# Altium project FET_Driver.PrjPcb (part 3 of 3)

## Sheet current_sense.SchDoc
size B; Address1: MILWAUKEE TOOL; Address2: 13135 W. Lisbon Rd.; Address3: Brookfield, WI 53005; SheetNumber: 1; SheetTotal: 1
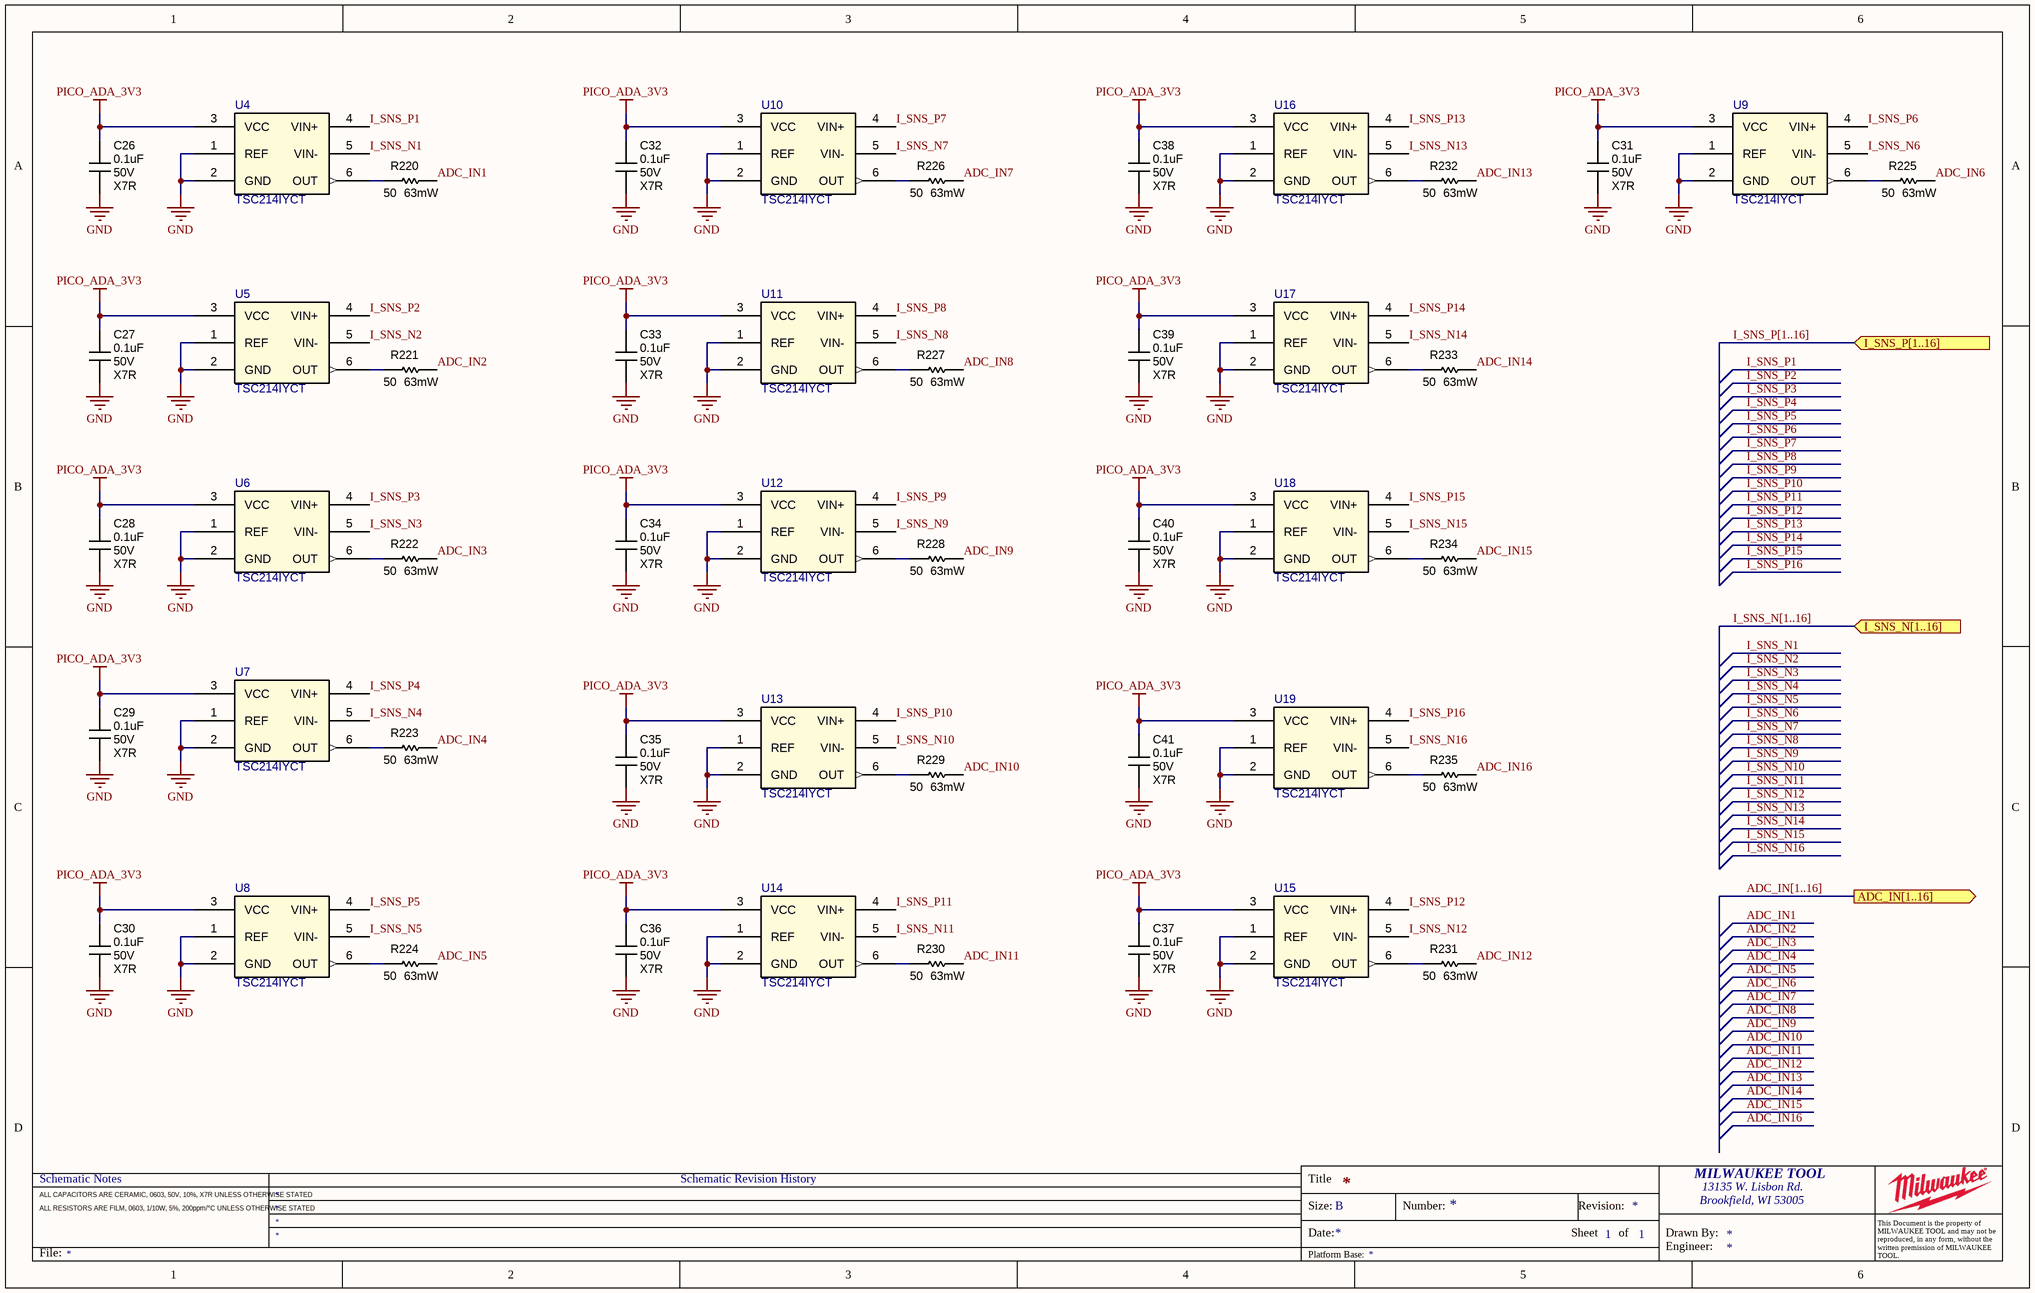
[diagram p9: current_sense.SchDoc]

### Parts
C26  0.1uF  Voltage Rating: 50V  Temp Coeff: X7R  [CAPC1005X06N]
C27  0.1uF  Voltage Rating: 50V  Temp Coeff: X7R  [CAPC1005X06N]
C28  0.1uF  Voltage Rating: 50V  Temp Coeff: X7R  [CAPC1005X06N]
C29  0.1uF  Voltage Rating: 50V  Temp Coeff: X7R  [CAPC1005X06N]
C30  0.1uF  Voltage Rating: 50V  Temp Coeff: X7R  [CAPC1005X06N]
C31  0.1uF  Voltage Rating: 50V  Temp Coeff: X7R  [CAPC1005X06N]
C32  0.1uF  Voltage Rating: 50V  Temp Coeff: X7R  [CAPC1005X06N]
C33  0.1uF  Voltage Rating: 50V  Temp Coeff: X7R  [CAPC1005X06N]
C34  0.1uF  Voltage Rating: 50V  Temp Coeff: X7R  [CAPC1005X06N]
C35  0.1uF  Voltage Rating: 50V  Temp Coeff: X7R  [CAPC1005X06N]
C36  0.1uF  Voltage Rating: 50V  Temp Coeff: X7R  [CAPC1005X06N]
C37  0.1uF  Voltage Rating: 50V  Temp Coeff: X7R  [CAPC1005X06N]
C38  0.1uF  Voltage Rating: 50V  Temp Coeff: X7R  [CAPC1005X06N]
C39  0.1uF  Voltage Rating: 50V  Temp Coeff: X7R  [CAPC1005X06N]
C40  0.1uF  Voltage Rating: 50V  Temp Coeff: X7R  [CAPC1005X06N]
C41  0.1uF  Voltage Rating: 50V  Temp Coeff: X7R  [CAPC1005X06N]
R220  50  Wattage: 63mW  [RESC1005X04N]
R221  50  Wattage: 63mW  [RESC1005X04N]
R222  50  Wattage: 63mW  [RESC1005X04N]
R223  50  Wattage: 63mW  [RESC1005X04N]
R224  50  Wattage: 63mW  [RESC1005X04N]
R225  50  Wattage: 63mW  [RESC1005X04N]
R226  50  Wattage: 63mW  [RESC1005X04N]
R227  50  Wattage: 63mW  [RESC1005X04N]
R228  50  Wattage: 63mW  [RESC1005X04N]
R229  50  Wattage: 63mW  [RESC1005X04N]
R230  50  Wattage: 63mW  [RESC1005X04N]
R231  50  Wattage: 63mW  [RESC1005X04N]
R232  50  Wattage: 63mW  [RESC1005X04N]
R233  50  Wattage: 63mW  [RESC1005X04N]
R234  50  Wattage: 63mW  [RESC1005X04N]
R235  50  Wattage: 63mW  [RESC1005X04N]
U4  TSC214IYCT  [SOT65P210X110-6N]
U5  TSC214IYCT  [SOT65P210X110-6N]
U6  TSC214IYCT  [SOT65P210X110-6N]
U7  TSC214IYCT  [SOT65P210X110-6N]
U8  TSC214IYCT  [SOT65P210X110-6N]
U9  TSC214IYCT  [SOT65P210X110-6N]
U10  TSC214IYCT  [SOT65P210X110-6N]
U11  TSC214IYCT  [SOT65P210X110-6N]
U12  TSC214IYCT  [SOT65P210X110-6N]
U13  TSC214IYCT  [SOT65P210X110-6N]
U14  TSC214IYCT  [SOT65P210X110-6N]
U15  TSC214IYCT  [SOT65P210X110-6N]
U16  TSC214IYCT  [SOT65P210X110-6N]
U17  TSC214IYCT  [SOT65P210X110-6N]
U18  TSC214IYCT  [SOT65P210X110-6N]
U19  TSC214IYCT  [SOT65P210X110-6N]

### Ports
ADC_IN[1..16] (out), I_SNS_N[1..16] (in), I_SNS_P[1..16] (in)

### Nets
GND: C26.2 C27.2 C28.2 C29.2 C30.2 C31.2 C32.2 C33.2 C34.2 C35.2 C36.2 C37.2 C38.2 C39.2 C40.2 C41.2 U4.1(REF) U4.2(GND) U5.1(REF) U5.2(GND) U6.1(REF) U6.2(GND) U7.1(REF) U7.2(GND) U8.1(REF) U8.2(GND) U9.1(REF) U9.2(GND) U10.1(REF) U10.2(GND) U11.1(REF) U11.2(GND) U12.1(REF) U12.2(GND) U13.1(REF) U13.2(GND) U14.1(REF) U14.2(GND) U15.1(REF) U15.2(GND) U16.1(REF) U16.2(GND) U17.1(REF) U17.2(GND) U18.1(REF) U18.2(GND) U19.1(REF) U19.2(GND)
PICO_ADA_3V3: C26.1 C27.1 C28.1 C29.1 C30.1 C31.1 C32.1 C33.1 C34.1 C35.1 C36.1 C37.1 C38.1 C39.1 C40.1 C41.1 U4.3(VCC) U5.3(VCC) U6.3(VCC) U7.3(VCC) U8.3(VCC) U9.3(VCC) U10.3(VCC) U11.3(VCC) U12.3(VCC) U13.3(VCC) U14.3(VCC) U15.3(VCC) U16.3(VCC) U17.3(VCC) U18.3(VCC) U19.3(VCC)
ADC_IN1: R220.2
ADC_IN2: R221.2
ADC_IN3: R222.2
ADC_IN4: R223.2
ADC_IN5: R224.2
ADC_IN6: R225.2
ADC_IN7: R226.2
ADC_IN8: R227.2
ADC_IN9: R228.2
ADC_IN10: R229.2
ADC_IN11: R230.2
ADC_IN12: R231.2
ADC_IN13: R232.2
ADC_IN14: R233.2
ADC_IN15: R234.2
ADC_IN16: R235.2
I_SNS_N1: U4.5(VIN-)
I_SNS_N2: U5.5(VIN-)
I_SNS_N3: U6.5(VIN-)
I_SNS_N4: U7.5(VIN-)
I_SNS_N5: U8.5(VIN-)
I_SNS_N6: U9.5(VIN-)
I_SNS_N7: U10.5(VIN-)
I_SNS_N8: U11.5(VIN-)
I_SNS_N9: U12.5(VIN-)
I_SNS_N10: U13.5(VIN-)
I_SNS_N11: U14.5(VIN-)
I_SNS_N12: U15.5(VIN-)
I_SNS_N13: U16.5(VIN-)
I_SNS_N14: U17.5(VIN-)
I_SNS_N15: U18.5(VIN-)
I_SNS_N16: U19.5(VIN-)
I_SNS_P1: U4.4(VIN+)
I_SNS_P2: U5.4(VIN+)
I_SNS_P3: U6.4(VIN+)
I_SNS_P4: U7.4(VIN+)
I_SNS_P5: U8.4(VIN+)
I_SNS_P6: U9.4(VIN+)
I_SNS_P7: U10.4(VIN+)
I_SNS_P8: U11.4(VIN+)
I_SNS_P9: U12.4(VIN+)
I_SNS_P10: U13.4(VIN+)
I_SNS_P11: U14.4(VIN+)
I_SNS_P12: U15.4(VIN+)
I_SNS_P13: U16.4(VIN+)
I_SNS_P14: U17.4(VIN+)
I_SNS_P15: U18.4(VIN+)
I_SNS_P16: U19.4(VIN+)
NetR220_1: R220.1 U4.6(OUT)
NetR221_1: R221.1 U5.6(OUT)
NetR222_1: R222.1 U6.6(OUT)
NetR223_1: R223.1 U7.6(OUT)
NetR224_1: R224.1 U8.6(OUT)
NetR225_1: R225.1 U9.6(OUT)
NetR226_1: R226.1 U10.6(OUT)
NetR227_1: R227.1 U11.6(OUT)
NetR228_1: R228.1 U12.6(OUT)
NetR229_1: R229.1 U13.6(OUT)
NetR230_1: R230.1 U14.6(OUT)
NetR231_1: R231.1 U15.6(OUT)
NetR232_1: R232.1 U16.6(OUT)
NetR233_1: R233.1 U17.6(OUT)
NetR234_1: R234.1 U18.6(OUT)
NetR235_1: R235.1 U19.6(OUT)

### Buses and harness runs
bus ADC_IN[1..16] = port ADC_IN[1..16]
bus I_SNS_N[1..16] = port I_SNS_N[1..16]
bus I_SNS_P[1..16] = port I_SNS_P[1..16]

### Notes on the sheet
- Schematic Notes
- Schematic Revision History
- Title
- ALL CAPACITORS ARE CERAMIC, 0603, 50V, 10%, X7R UNLESS OTHERWISE STATED
- ALL RESISTORS ARE FILM, 0603, 1/10W, 5%, 200ppm/°C UNLESS OTHERWISE STATED
- Size:
- Date:
- B
- Number:
- Sheet
- Revision:
- of
- Drawn By:
- Brookfield, WI 53005
- File:
- Platform Base:
- Engineer:
- This Document is the property of MILWAUKEE TOOL and may not be reproduced, in any form, without the written premission of MILWAUKEE TOOL.

### Library data of the parts
C26-C41 = CMP-004-0076: as C45-C47 on sheet thermocouple_1; Case Code (Imperial): 0402; Value: 0.1uF; MFR4: Samsung Electro-Mechanics; Design Item ID: CN/0.1uF/50V/X7R/10%/0402; Case Code (Metric): 1005; ComponentLink1URL: https://search.murata.co.jp/Ceramy/image/img/A01X/G101/ENG/GRM155R71H104KE14-01.pdf; MFR3: KYOCERA AVX; MFR2: TDK Corporation; ComponentLink1Description: Datasheet; RoHS Compliant: Yes; Part Status: Production
R220-R235 = CMP-025-0174: RES SMD 50R OHM 1% 1/16W 0402; MFR#: RN73R1ETTP50R0F50; MFR: KOA Speer Electronics; Value: 50 Ohm; Temp Range: -55 / +155 C; Temperature Coefficient: 50 ppm/°C; Populate: Yes; Tolerance: 1%; ComponentLink1Description: Datasheet; ComponentLink1URL: https://www.koaspeer.com/pdfs/RN73R.pdf; Resistor Type: Thick Film; Case Code (Imperial): 0402; Case Code (Metric): 1005; Design Item ID: R/50.0/0.063W/1%/0402; RoHS Compliant: Yes; Part Status: Production
U4-U19 = CMP-017-0113: IC CURR SENSE 1 CIRCUIT SC70-6; MFR: STMicroelectronics; Populate: Yes; REACFH SVCH: Unaffected; Temp Range, Ambient: -40 / +85 C; Voltage Range: 2.7V - 26V DC; Temp Range, Junction: -40 / +125C; Value: TSC214IYCT; MFR#: TSC214IYCT; Case Package: sot23-6; Design Item ID: IC/I_SNS/TSC214/SOT23-6; Part Status: Production; RoHS Comliant: Yes; Type: CURRENT SENSOR; ComponentLink1Description: Datasheet; ComponentLink1URL: https://www.st.com/resource/en/datasheet/tsc210.pdf

## Sheet pwm_driver.SchDoc
size B; Address1: MILWAUKEE TOOL; Address2: 13135 W. Lisbon Rd.; Address3: Brookfield, WI 53005; SheetNumber: 1; SheetTotal: 1
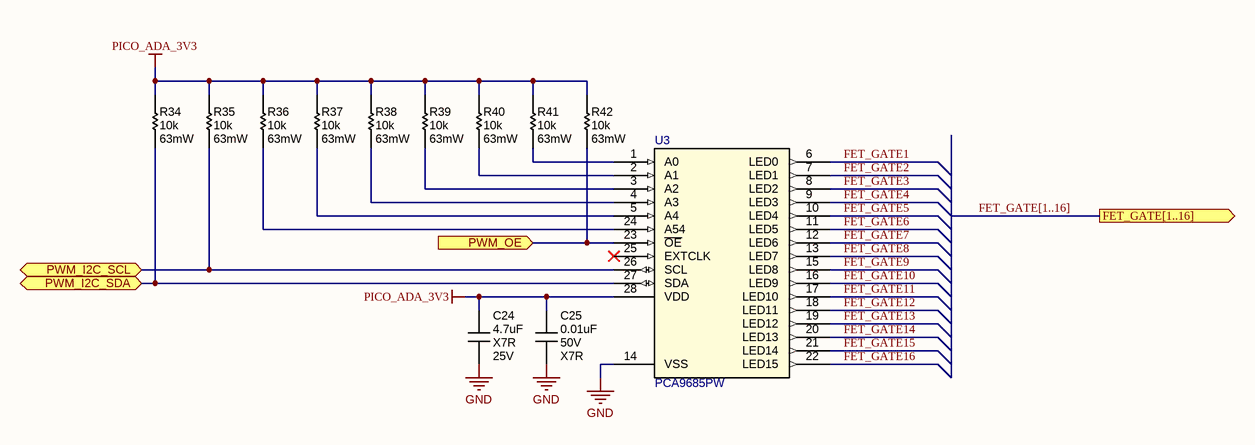
[diagram p10: pwm_driver.SchDoc]

### Parts
C24  4.7uF  Temp Coeff: X7R  Voltage Rating: 25V  [CAPC2012X14N]
C25  0.01uF  Voltage Rating: 50V  Temp Coeff: X7R  [CAPC1005X06N]
R34  10k  Wattage: 63mW  [RESC1005X04N]
R35  10k  Wattage: 63mW  [RESC1005X04N]
R36  10k  Wattage: 63mW  [RESC1005X04N]
R37  10k  Wattage: 63mW  [RESC1005X04N]
R38  10k  Wattage: 63mW  [RESC1005X04N]
R39  10k  Wattage: 63mW  [RESC1005X04N]
R40  10k  Wattage: 63mW  [RESC1005X04N]
R41  10k  Wattage: 63mW  [RESC1005X04N]
R42  10k  Wattage: 63mW  [RESC1005X04N]
U3  PCA9685PW  [SOP65P640X120-29N]

### Ports
FET_GATE[1..16] (out), PWM_I2C_SCL (bidir), PWM_I2C_SDA (bidir), PWM_OE (in)

### Nets
GND: C24.2 C25.2 U3.14(VSS)
PICO_ADA_3V3: C24.1 C25.1 R34.2 R35.2 R36.2 R37.2 R38.2 R39.2 R40.2 R41.2 R42.2 U3.28(VDD)
FET_GATE1: U3.6(LED0)
FET_GATE2: U3.7(LED1)
FET_GATE3: U3.8(LED2)
FET_GATE4: U3.9(LED3)
FET_GATE5: U3.10(LED4)
FET_GATE6: U3.11(LED5)
FET_GATE7: U3.12(LED6)
FET_GATE8: U3.13(LED7)
FET_GATE9: U3.15(LED8)
FET_GATE10: U3.16(LED9)
FET_GATE11: U3.17(LED10)
FET_GATE12: U3.18(LED11)
FET_GATE13: U3.19(LED12)
FET_GATE14: U3.20(LED13)
FET_GATE15: U3.21(LED14)
FET_GATE16: U3.22(LED15)
I2C1_SCL: R35.1 U3.26(SCL) ; port PWM_I2C_SCL
I2C1_SDA: R34.1 U3.27(SDA) ; port PWM_I2C_SDA
OUTPUT_ENABLE: R42.1 U3.23(~{OE}) ; port PWM_OE
NetR36_1: R36.1 U3.24(A54)
NetR37_1: R37.1 U3.5(A4)
NetR38_1: R38.1 U3.4(A3)
NetR39_1: R39.1 U3.3(A2)
NetR40_1: R40.1 U3.2(A1)
NetR41_1: R41.1 U3.1(A0)

Not connected (* = marked no-connect by the designer): U3 25(EXTCLK)*

### Buses and harness runs
bus FET_GATE[1..16] = port FET_GATE[1..16]

### Notes on the sheet
- Schematic Notes
- Schematic Revision History
- Title
- ALL CAPACITORS ARE CERAMIC, 0603, 50V, 10%, X7R UNLESS OTHERWISE STATED
- ALL RESISTORS ARE FILM, 0603, 1/10W, 5%, 200ppm/°C UNLESS OTHERWISE STATED
- Size:
- Date:
- B
- Number:
- Sheet
- Revision:
- of
- Drawn By:
- Brookfield, WI 53005
- File:
- Platform Base:
- Engineer:
- This Document is the property of MILWAUKEE TOOL and may not be reproduced, in any form, without the written premission of MILWAUKEE TOOL.

### Library data of the parts
C24 = CMP-004-0011: CAP CER 4.7UF 25V X7R 0805; MFR: TDK Corporation; MFR3#: 0805B475K500NT; MFR#: C2012X7R1E475K125AE; MFR2#: CL21B475KAFNNNE; Temp Range: -55 / +125 C; Tolerance: 10%; Capacitor Type: Ceramic; MFR2: Samsung Electro-Mechanics; Case Code (Metric): 2012; REACH SVHC: Yes; ComponentLink1URL: https://search.murata.co.jp/Ceramy/image/img/A01X/G101/ENG/GRM32EC72A106KE05-01.pdf; MFR3: FengHua; Design Item ID: CN/4.7uF/25V/X7R/10%/0805; Value: 4.7uF; RoHS Compliant: Yes; ComponentLink1Description: Datasheet; Case Code (Imperial): 0805
C25 = CMP-004-0077: CAP CER SMD 0.01UF 50V X7R 0402; MFR3#: C0402C103K5RAC7867; MFR#: GCM155R71H103KA55D; MFR: Murata Electronics; MFR4#: CL05B103KB5NNNC; MFR2#: CC0402KRX7R9BB103; Tolerance: 10%; Populate: Yes; Temp Range: -55 / +125 C; Capacitor Type: Ceramic; Case Code (Imperial): 0402; Value: 0.01uF; MFR4: Samsung Electro-Mechanics; Design Item ID: CN/0.01UF/50V/X7R/10%/0402; Case Code (Metric): 1005; ComponentLink1URL: https://search.murata.co.jp/Ceramy/image/img/A01X/G101/ENG/GCM155R71H103KA55-01.pdf; MFR3: KEMET; MFR2: YAGEO; ComponentLink1Description: Datasheet; RoHS Compliant: Yes; Part Status: Production
R34-R42 = CMP-025-0026: as R52-R54 on sheet thermocouple_1; MFR2: Stackpole Electronics Inc; RoHS Compliant: Yes; ComponentLink1Description: Datasheet; REACH SVHC: Yes; Value: 10k; Case Code (Imperial): 0402; Case Code (Metric): 1005; Tolerance: 0.5%; Resistor Type: Thick Film; Design Item ID: R/10.0K/0.063W/0.5%/0402; ComponentLink1URL: https://industrial.panasonic.com/cdbs/www-data/pdf/RDM0000/AOA0000C307.pdf
U3 = CMP-017-0112: IC LED DRVR LIN PWM 25MA 28TSSOP; MFR: NXP; Value: PCA9685PW,118; Populate: Yes; REACFH SVCH: Unaffected; Temp Range, Ambient: -40 / +85 C; Voltage Range: 2.3V - 5.5V DC; Temp Range, Junction: -40 / +125C; MFR#: PCA9685PW,118; Case Package: TSSOP28; Design Item ID: IC/LDRV/PCA9685PW/TSSOP28; Part Status: Production; RoHS Comliant: Yes; Type: PWM CONTROLLER; ComponentLink1Description: Datasheet; ComponentLink1URL: https://www.nxp.com/docs/en/data-sheet/PCA9685.pdf

## Sheet FETS.SchDoc
size B; Address1: MILWAUKEE TOOL; Address2: 13135 W. Lisbon Rd.; Address3: Brookfield, WI 53005; SheetNumber: 1; SheetTotal: 1
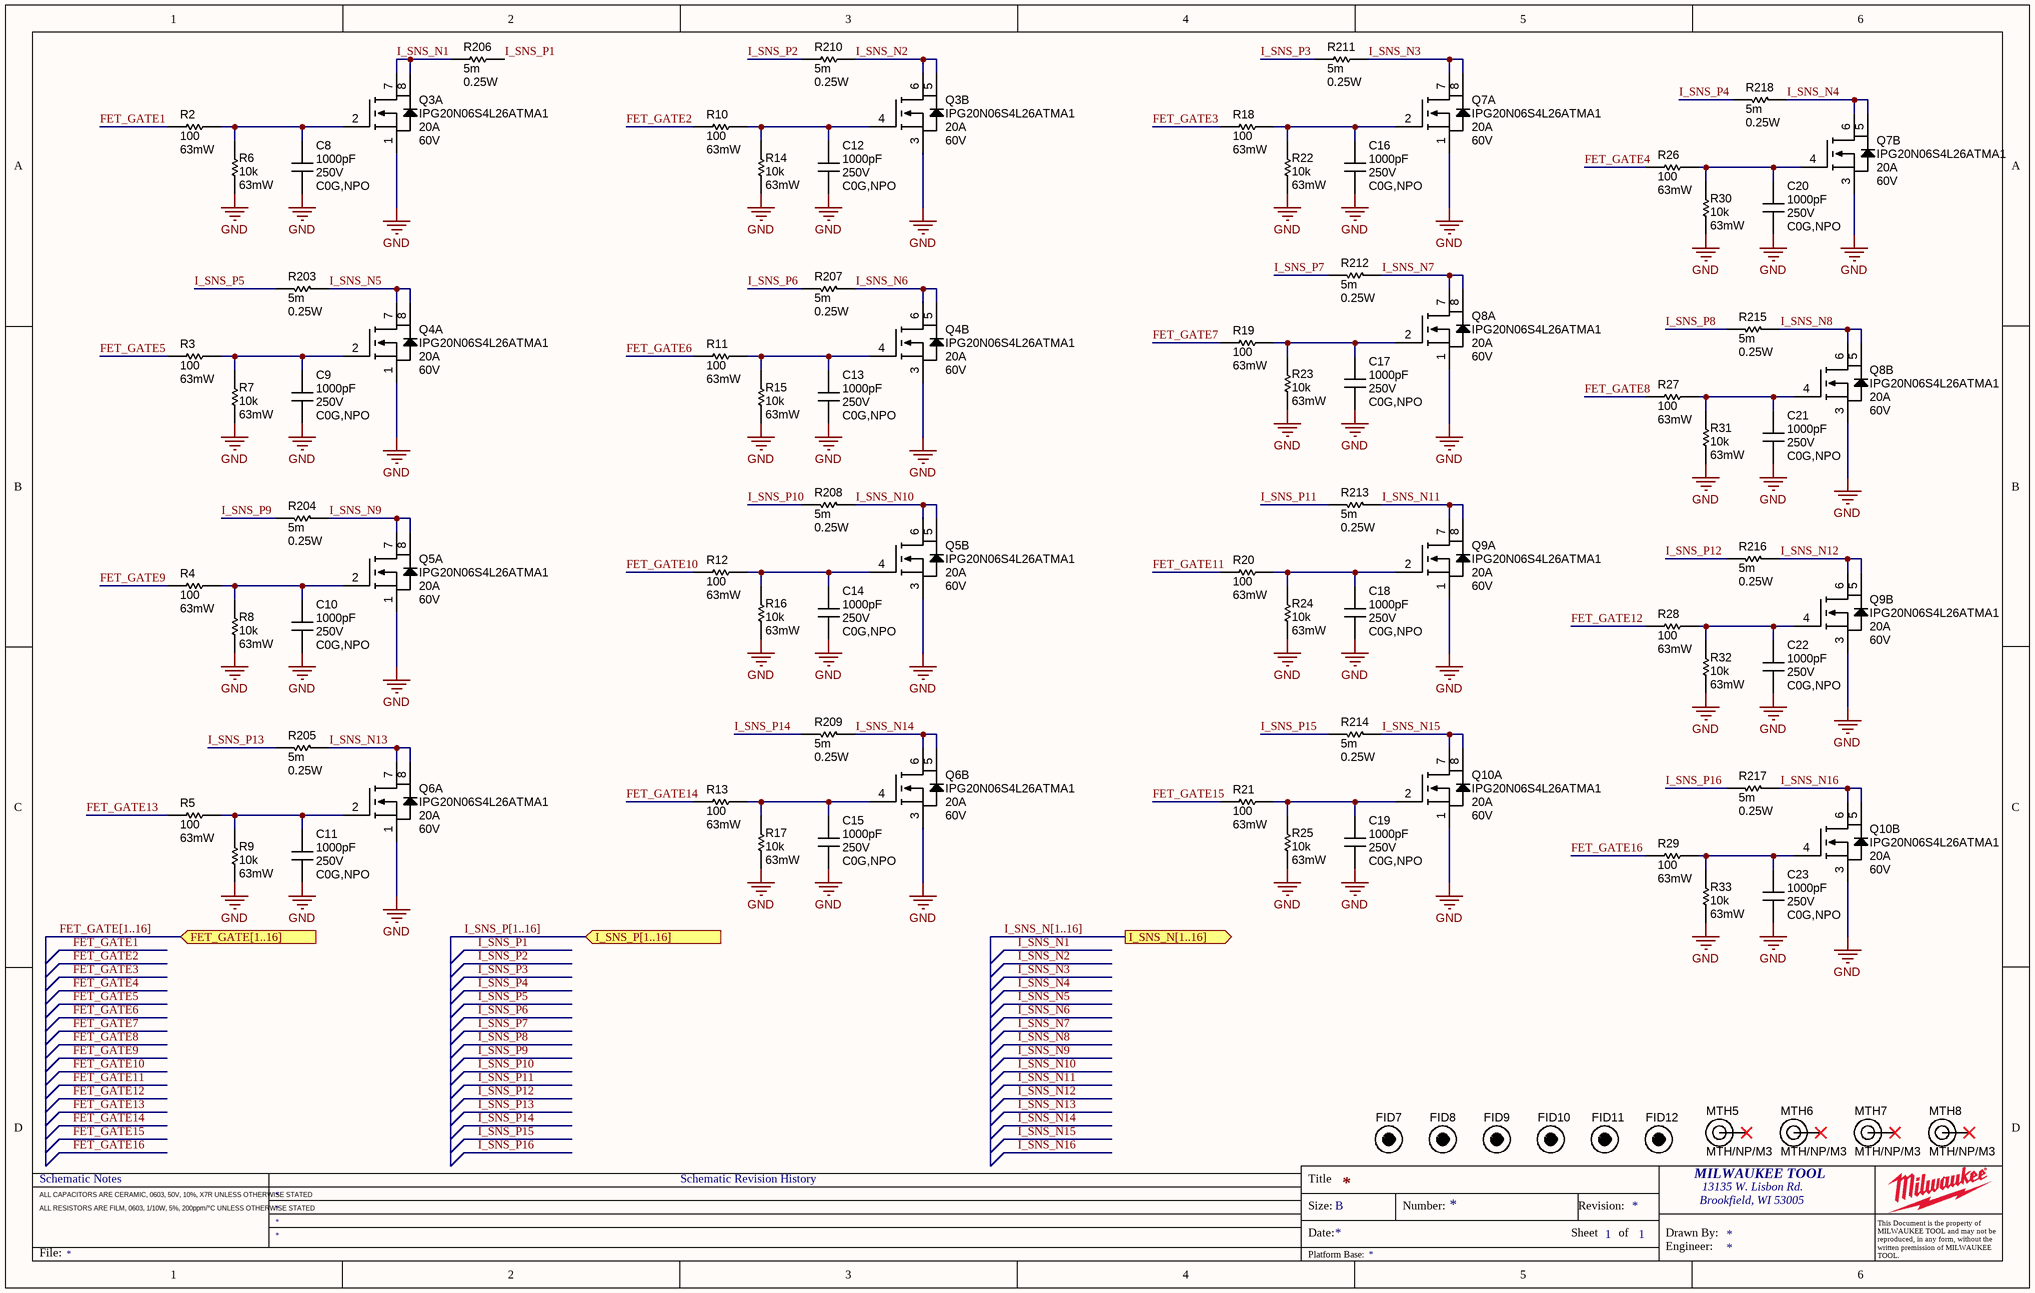
[diagram p11: FETS.SchDoc]

### Parts
C8  1000pF  Voltage Rating: 250V  Temp Coeff: C0G,NPO  [CAPC1608X09N]
C9  1000pF  Voltage Rating: 250V  Temp Coeff: C0G,NPO  [CAPC1608X09N]
C10  1000pF  Voltage Rating: 250V  Temp Coeff: C0G,NPO  [CAPC1608X09N]
C11  1000pF  Voltage Rating: 250V  Temp Coeff: C0G,NPO  [CAPC1608X09N]
C12  1000pF  Voltage Rating: 250V  Temp Coeff: C0G,NPO  [CAPC1608X09N]
C13  1000pF  Voltage Rating: 250V  Temp Coeff: C0G,NPO  [CAPC1608X09N]
C14  1000pF  Voltage Rating: 250V  Temp Coeff: C0G,NPO  [CAPC1608X09N]
C15  1000pF  Voltage Rating: 250V  Temp Coeff: C0G,NPO  [CAPC1608X09N]
C16  1000pF  Voltage Rating: 250V  Temp Coeff: C0G,NPO  [CAPC1608X09N]
C17  1000pF  Voltage Rating: 250V  Temp Coeff: C0G,NPO  [CAPC1608X09N]
C18  1000pF  Voltage Rating: 250V  Temp Coeff: C0G,NPO  [CAPC1608X09N]
C19  1000pF  Voltage Rating: 250V  Temp Coeff: C0G,NPO  [CAPC1608X09N]
C20  1000pF  Voltage Rating: 250V  Temp Coeff: C0G,NPO  [CAPC1608X09N]
C21  1000pF  Voltage Rating: 250V  Temp Coeff: C0G,NPO  [CAPC1608X09N]
C22  1000pF  Voltage Rating: 250V  Temp Coeff: C0G,NPO  [CAPC1608X09N]
C23  1000pF  Voltage Rating: 250V  Temp Coeff: C0G,NPO  [CAPC1608X09N]
FID7  FIDUCIAL STANDARD  [FID]  (value not drawn)  (no BOM)
FID8  FIDUCIAL STANDARD  [FID]  (value not drawn)  (no BOM)
FID9  FIDUCIAL STANDARD  [FID]  (value not drawn)  (no BOM)
FID10  FIDUCIAL STANDARD  [FID]  (value not drawn)  (no BOM)
FID11  FIDUCIAL STANDARD  [FID]  (value not drawn)  (no BOM)
FID12  FIDUCIAL STANDARD  [FID]  (value not drawn)  (no BOM)
MTH5  MTH/NP/M3  [MTGNP700H325Z700P]  (no BOM)
MTH6  MTH/NP/M3  [MTGNP700H325Z700P]  (no BOM)
MTH7  MTH/NP/M3  [MTGNP700H325Z700P]  (no BOM)
MTH8  MTH/NP/M3  [MTGNP700H325Z700P]  (no BOM)
Q3  IPG20N06S4L26ATMA1  Current: 20A  Voltage: 60V  [INF-PG-TDSON-8-4]  (parts A,B of 2)
Q4  IPG20N06S4L26ATMA1  Current: 20A  Voltage: 60V  [INF-PG-TDSON-8-4]  (parts A,B of 2)
Q5  IPG20N06S4L26ATMA1  Current: 20A  Voltage: 60V  [INF-PG-TDSON-8-4]  (parts A,B of 2)
Q6  IPG20N06S4L26ATMA1  Current: 20A  Voltage: 60V  [INF-PG-TDSON-8-4]  (parts A,B of 2)
Q7  IPG20N06S4L26ATMA1  Current: 20A  Voltage: 60V  [INF-PG-TDSON-8-4]  (parts A,B of 2)
Q8  IPG20N06S4L26ATMA1  Current: 20A  Voltage: 60V  [INF-PG-TDSON-8-4]  (parts A,B of 2)
Q9  IPG20N06S4L26ATMA1  Current: 20A  Voltage: 60V  [INF-PG-TDSON-8-4]  (parts A,B of 2)
Q10  IPG20N06S4L26ATMA1  Current: 20A  Voltage: 60V  [INF-PG-TDSON-8-4]  (parts A,B of 2)
R2  100  Wattage: 63mW  [RESC1005X04N]
R3  100  Wattage: 63mW  [RESC1005X04N]
R4  100  Wattage: 63mW  [RESC1005X04N]
R5  100  Wattage: 63mW  [RESC1005X04N]
R6  10k  Wattage: 63mW  [RESC1005X04N]
R7  10k  Wattage: 63mW  [RESC1005X04N]
R8  10k  Wattage: 63mW  [RESC1005X04N]
R9  10k  Wattage: 63mW  [RESC1005X04N]
R10  100  Wattage: 63mW  [RESC1005X04N]
R11  100  Wattage: 63mW  [RESC1005X04N]
R12  100  Wattage: 63mW  [RESC1005X04N]
R13  100  Wattage: 63mW  [RESC1005X04N]
R14  10k  Wattage: 63mW  [RESC1005X04N]
R15  10k  Wattage: 63mW  [RESC1005X04N]
R16  10k  Wattage: 63mW  [RESC1005X04N]
R17  10k  Wattage: 63mW  [RESC1005X04N]
R18  100  Wattage: 63mW  [RESC1005X04N]
R19  100  Wattage: 63mW  [RESC1005X04N]
R20  100  Wattage: 63mW  [RESC1005X04N]
R21  100  Wattage: 63mW  [RESC1005X04N]
R22  10k  Wattage: 63mW  [RESC1005X04N]
R23  10k  Wattage: 63mW  [RESC1005X04N]
R24  10k  Wattage: 63mW  [RESC1005X04N]
R25  10k  Wattage: 63mW  [RESC1005X04N]
R26  100  Wattage: 63mW  [RESC1005X04N]
R27  100  Wattage: 63mW  [RESC1005X04N]
R28  100  Wattage: 63mW  [RESC1005X04N]
R29  100  Wattage: 63mW  [RESC1005X04N]
R30  10k  Wattage: 63mW  [RESC1005X04N]
R31  10k  Wattage: 63mW  [RESC1005X04N]
R32  10k  Wattage: 63mW  [RESC1005X04N]
R33  10k  Wattage: 63mW  [RESC1005X04N]
R203  5m  Wattage: 0.25W  [RESC3115X07N]
R204  5m  Wattage: 0.25W  [RESC3115X07N]
R205  5m  Wattage: 0.25W  [RESC3115X07N]
R206  5m  Wattage: 0.25W  [RESC3115X07N]
R207  5m  Wattage: 0.25W  [RESC3115X07N]
R208  5m  Wattage: 0.25W  [RESC3115X07N]
R209  5m  Wattage: 0.25W  [RESC3115X07N]
R210  5m  Wattage: 0.25W  [RESC3115X07N]
R211  5m  Wattage: 0.25W  [RESC3115X07N]
R212  5m  Wattage: 0.25W  [RESC3115X07N]
R213  5m  Wattage: 0.25W  [RESC3115X07N]
R214  5m  Wattage: 0.25W  [RESC3115X07N]
R215  5m  Wattage: 0.25W  [RESC3115X07N]
R216  5m  Wattage: 0.25W  [RESC3115X07N]
R217  5m  Wattage: 0.25W  [RESC3115X07N]
R218  5m  Wattage: 0.25W  [RESC3115X07N]

### Ports
FET_GATE[1..16] (in), I_SNS_N[1..16] (out), I_SNS_P[1..16] (in)

### Nets
GND: C8.2 C9.2 C10.2 C11.2 C12.2 C13.2 C14.2 C15.2 C16.2 C17.2 C18.2 C19.2 C20.2 C21.2 C22.2 C23.2 Q3.1(S) Q3.3(S) Q4.1(S) Q4.3(S) Q5.1(S) Q5.3(S) Q6.1(S) Q6.3(S) Q7.1(S) Q7.3(S) Q8.1(S) Q8.3(S) Q9.1(S) Q9.3(S) Q10.1(S) Q10.3(S) R6.1 R7.1 R8.1 R9.1 R14.1 R15.1 R16.1 R17.1 R22.1 R23.1 R24.1 R25.1 R30.1 R31.1 R32.1 R33.1
FET_GATE1: R2.1
FET_GATE2: R10.1
FET_GATE3: R18.1
FET_GATE4: R26.1
FET_GATE5: R3.1
FET_GATE6: R11.1
FET_GATE7: R19.1
FET_GATE8: R27.1
FET_GATE9: R4.1
FET_GATE10: R12.1
FET_GATE11: R20.1
FET_GATE12: R28.1
FET_GATE13: R5.1
FET_GATE14: R13.1
FET_GATE15: R21.1
FET_GATE16: R29.1
I_SNS_N1: Q3.7(D) Q3.8(D) R206.1
I_SNS_N2: Q3.5(D) Q3.6(D) R210.2
I_SNS_N3: Q7.7(D) Q7.8(D) R211.2
I_SNS_N4: Q7.5(D) Q7.6(D) R218.1
I_SNS_N5: Q4.7(D) Q4.8(D) R203.1
I_SNS_N6: Q4.5(D) Q4.6(D) R207.1
I_SNS_N7: Q8.7(D) Q8.8(D) R212.1
I_SNS_N8: Q8.5(D) Q8.6(D) R215.1
I_SNS_N9: Q5.7(D) Q5.8(D) R204.1
I_SNS_N10: Q5.5(D) Q5.6(D) R208.1
I_SNS_N11: Q9.7(D) Q9.8(D) R213.1
I_SNS_N12: Q9.5(D) Q9.6(D) R216.1
I_SNS_N13: Q6.7(D) Q6.8(D) R205.1
I_SNS_N14: Q6.5(D) Q6.6(D) R209.1
I_SNS_N15: Q10.7(D) Q10.8(D) R214.1
I_SNS_N16: Q10.5(D) Q10.6(D) R217.1
I_SNS_P1: R206.2
I_SNS_P2: R210.1
I_SNS_P3: R211.1
I_SNS_P4: R218.2
I_SNS_P5: R203.2
I_SNS_P6: R207.2
I_SNS_P7: R212.2
I_SNS_P8: R215.2
I_SNS_P9: R204.2
I_SNS_P10: R208.2
I_SNS_P11: R213.2
I_SNS_P12: R216.2
I_SNS_P13: R205.2
I_SNS_P14: R209.2
I_SNS_P15: R214.2
I_SNS_P16: R217.2
NetC8_1: C8.1 Q3.2(G) R2.2 R6.2
NetC9_1: C9.1 Q4.2(G) R3.2 R7.2
NetC10_1: C10.1 Q5.2(G) R4.2 R8.2
NetC11_1: C11.1 Q6.2(G) R5.2 R9.2
NetC12_1: C12.1 Q3.4(G) R10.2 R14.2
NetC13_1: C13.1 Q4.4(G) R11.2 R15.2
NetC14_1: C14.1 Q5.4(G) R12.2 R16.2
NetC15_1: C15.1 Q6.4(G) R13.2 R17.2
NetC16_1: C16.1 Q7.2(G) R18.2 R22.2
NetC17_1: C17.1 Q8.2(G) R19.2 R23.2
NetC18_1: C18.1 Q9.2(G) R20.2 R24.2
NetC19_1: C19.1 Q10.2(G) R21.2 R25.2
NetC20_1: C20.1 Q7.4(G) R26.2 R30.2
NetC21_1: C21.1 Q8.4(G) R27.2 R31.2
NetC22_1: C22.1 Q9.4(G) R28.2 R32.2
NetC23_1: C23.1 Q10.4(G) R29.2 R33.2

Not connected (* = marked no-connect by the designer): MTH5 1*; MTH6 1*; MTH7 1*; MTH8 1*

### Buses and harness runs
bus FET_GATE[1..16] = port FET_GATE[1..16]
bus I_SNS_N[1..16] = port I_SNS_N[1..16]
bus I_SNS_P[1..16] = port I_SNS_P[1..16]

### Notes on the sheet
- Schematic Notes
- Schematic Revision History
- Title
- ALL CAPACITORS ARE CERAMIC, 0603, 50V, 10%, X7R UNLESS OTHERWISE STATED
- ALL RESISTORS ARE FILM, 0603, 1/10W, 5%, 200ppm/°C UNLESS OTHERWISE STATED
- Size:
- Date:
- B
- Number:
- Sheet
- Revision:
- of
- Drawn By:
- Brookfield, WI 53005
- File:
- Platform Base:
- Engineer:
- This Document is the property of MILWAUKEE TOOL and may not be reproduced, in any form, without the written premission of MILWAUKEE TOOL.

### Library data of the parts
C8-C23 = CMP-004-0013: CAP CER 1000PF 250V X7R 0603; MFR2#: C1608C0G2E102J080AA; MFR: KEMET; MFR#: C0603C102JAGAC7867; Tolerance: 5%; Capacitor Type: Ceramic; Temp Range: -55 / +125 C; Case Code (Imperial): 0603; Value: 1000pF; ComponentLink1Description: Datasheet; ComponentLink1URL: https://api.kemet.com/component-edge/download/datasheet/C0603C102K1RAC7411.pdf; RoHS Compliant: Yes; Design Item ID: CN/1000PF/250V/C0G,NPO/5%/0603; MFR2: TDK Corporation; REACH SVHC: Yes; Case Code (Metric): 1608
FID7-FID12 = CMP-019-0003: STANDARD PCB FIDUCIAL; Populate: DNP; Soldermask Dimensions: 1.3mm; Copper Dimensions: 1mm; Design Item ID: Fiducial, Standard
MTH5-MTH8 = CMP-022-0003: M3 Screw Mounted Hole Non-Plated; Drill size: 3.25mm; Annular Ring Size: 7mm; Bolt Diameter: 3mm; Populate: DNP; Bolt Head Size: 6.3mm; Design Item ID: MTH/NP/M3; ClassName: MTHole
Q3-Q10 = CMP-029-0047: MOSFET N-CH 25V 5.8A SOT23; MFR: Infineon; Rth(j-c): 4.5 C/W; Wattage: 33W; Rth(j-a): 100 C/W; Transistor Type: NCH; Populate: Yes; Temp Range, Junction: -55 / +175 C; Design Item ID: Q/NCH/D/60V/20A/IPG20N06S4L26ATMA1/8tdson; MFR#: IPG20N06S4L26ATMA1; Case/Package: PG-TDSON-8; REACH SVHC: No SVHC; Value: IPG20N06S4L26ATMA1; RoHS Compliant: Yes; Part Status: Production; ComponentLink1URL: https://www.diodes.com/assets/Datasheets/ds30041.pdf; ComponentLink1Description: Datasheet; Temp Range, Ambient: -55 / +175 C
R2-R5 R10-R13 R18-R21 R26-R29 = CMP-025-0156: RES SMD 100 OHM 1% 1/16W 0402; MFR4#: CR0402-FX-1000GLF; MFR#: RMCF0402FT100R; MFR: Stackpole Electronics Inc; MFR3#: CRCW0402100RFKED; MFR2#: RC0402FR-07100RL; Value: 100 Ohm; Voltage Rating: 75V; Temp Range: -55 / +155 C; Current: 1A; Temperature Coefficient: 100ppm/°C; Populate: Yes; MFR2: YAGEO; Tolerance: 1%; MFR3: Vishay Dale; ComponentLink1Description: Datasheet; ComponentLink1URL: https://www.yageo.com/upload/media/product/products/datasheet/rchip/PYu-RC_Group_51_RoHS_L_12.pdf; Resistor Type: Thick Film; Case Code (Imperial): 0402; MFR4: Bourns Inc; Case Code (Metric): 1005; Design Item ID: R/100.0/0.063W/1%/0402; RoHS Compliant: Yes
R6-R9 R14-R17 R22-R25 R30-R33 = CMP-025-0026: as R52-R54 on sheet thermocouple_1; MFR2: Stackpole Electronics Inc; RoHS Compliant: Yes; ComponentLink1Description: Datasheet; REACH SVHC: Yes; Value: 10k; Case Code (Imperial): 0402; Case Code (Metric): 1005; Tolerance: 0.5%; Resistor Type: Thick Film; Design Item ID: R/10.0K/0.063W/0.5%/0402; ComponentLink1URL: https://industrial.panasonic.com/cdbs/www-data/pdf/RDM0000/AOA0000C307.pdf
R203-R218 = CMP-025-0170: RES SMD 5m OHM 1% 1/4W 1206; MFR#: PE1206FRF070R005L; MFR: YAGEO; Value: 5m Ohm; Voltage Rating: 250V; Temp Range: -55 / +155 C; Current: 6A; Temperature Coefficient: 600ppm/°C; Populate: Yes; Tolerance: 1%; ComponentLink1Description: Datasheet; ComponentLink1URL: https://www.yageo.com/upload/media/product/app/datasheet/rchip/pyu-rl_group_521_rohs_l.pdf; Resistor Type: Thick Film; Case Code (Imperial): 1206; Case Code (Metric): 3216; Design Item ID: R/0.005/0.25W/1%/1206; RoHS Compliant: Yes; Part Status: Production

## Sheet rtc.SchDoc
size B; Address1: MILWAUKEE TOOL; Address2: 13135 W. Lisbon Rd.; Address3: Brookfield, WI 53005; SheetNumber: 1; SheetTotal: 1
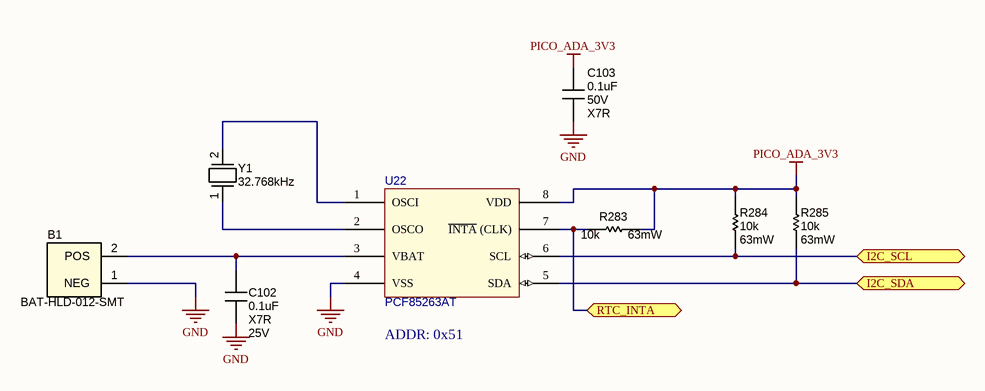
[diagram p12: rtc.SchDoc]

### Parts
B1  BAT-HLD-012-SMT  [BAT-HLD-012-SMT]
C102  0.1uF  Temp Coeff: X7R  Voltage Rating: 25V  [CAPC1608X09N]
C103  0.1uF  Voltage Rating: 50V  Temp Coeff: X7R  [CAPC1005X06N]
R283  10k  Wattage: 63mW  [RESC1005X04N]
R284  10k  Wattage: 63mW  [RESC1005X04N]
R285  10k  Wattage: 63mW  [RESC1005X04N]
U22  PCF85263AT  [SOIC127P600X175-8N]
Y1  32.768kHz  [XTAL_ECS_ECX-12Q]

### Ports
I2C_SCL (bidir), I2C_SDA (bidir), RTC_INTA (bidir)

### Nets
GND: B1.1(NEG) C102.2 C103.2 U22.4(VSS)
PICO_ADA_3V3: C103.1 R283.1 R284.2 R285.2 U22.8(VDD)
I2C1_SCL: R284.1 U22.6(SCL) ; port I2C_SCL
I2C1_SDA: R285.1 U22.5(SDA) ; port I2C_SDA
RTC_INTA: R283.2 U22.7(~{INTA}_(CLK)) ; port RTC_INTA
NetB1_2: B1.2(POS) C102.1 U22.3(VBAT)
NetU22_1: U22.1(OSCI) Y1.2
NetU22_2: U22.2(OSCO) Y1.1

### Notes on the sheet
- (near U22) ADDR: 0x51
- Schematic Notes
- Schematic Revision History
- Title
- ALL CAPACITORS ARE CERAMIC, 0603, 50V, 10%, X7R UNLESS OTHERWISE STATED
- ALL RESISTORS ARE FILM, 0603, 1/10W, 5%, 200ppm/°C UNLESS OTHERWISE STATED
- Size:
- Date:
- B
- Number:
- Sheet
- Revision:
- of
- Drawn By:
- Brookfield, WI 53005
- File:
- Platform Base:
- Engineer:
- This Document is the property of MILWAUKEE TOOL and may not be reproduced, in any form, without the written premission of MILWAUKEE TOOL.

### Library data of the parts
B1 = CMP-002-0005: BATTERY HOLDER COIN 12MM PC PIN; MFR: TE Connectivity Linx; MFR#: BAT-HLD-012-SMT; Design Item ID: BT/HLDR/SINGLE/COIN/12MM/BAT-HLD-012-SMT; Value: BAT-HLD-012-SMT
C102 = CMP-004-0024: CAP CER 0.1UF 25V X7R 0603; MFR#: CC0603JRX7R8BB104; MFR: Yageo; MFR2#: 0603B104J250CT; Temp Range: -55 / +125 C; Tolerance: 10%; Capacitor Type: Ceramic; Case Code (Imperial): 0608; Design Item ID: CN/0.1uF/25V/X7R/5%/0603; REACH SVHC: Yes; Value: 0.1uF; Height: 0.8mm; MFR2: Walsin; RoHS Compliant: Yes; Case Code (Metric): 1608
C103 = CMP-004-0076: as C45-C47 on sheet thermocouple_1; Case Code (Imperial): 0402; Value: 0.1uF; MFR4: Samsung Electro-Mechanics; Design Item ID: CN/0.1uF/50V/X7R/10%/0402; Case Code (Metric): 1005; ComponentLink1URL: https://search.murata.co.jp/Ceramy/image/img/A01X/G101/ENG/GRM155R71H104KE14-01.pdf; MFR3: KYOCERA AVX; MFR2: TDK Corporation; ComponentLink1Description: Datasheet; RoHS Compliant: Yes; Part Status: Production
R283-R285 = CMP-025-0026: as R52-R54 on sheet thermocouple_1; MFR2: Stackpole Electronics Inc; RoHS Compliant: Yes; ComponentLink1Description: Datasheet; REACH SVHC: Yes; Value: 10k; Case Code (Imperial): 0402; Case Code (Metric): 1005; Tolerance: 0.5%; Resistor Type: Thick Film; Design Item ID: R/10.0K/0.063W/0.5%/0402; ComponentLink1URL: https://industrial.panasonic.com/cdbs/www-data/pdf/RDM0000/AOA0000C307.pdf
U22 = CMP-017-0120: IC OPAMP VFB 1 CIRCUIT 8HVSSOP; MFR: NXP; MFR#: PCF85263AT/AJ; Populate: Yes; REACFH SVCH: Unaffected; Temp Range, Ambient: -40 / +85 C; Voltage Range, Input: 4.5V - 36V DC; Temp Range, Junction: -40 / +150C; Voltage Rating, Output: 0.6V - 36V DC; Value: PCF85263AT/AJ; Design Item ID: IC/RTC/PCF85263AT/SOIC8; Part Status: Production; RoHS Comliant: Yes; Type: RTC; ComponentLink1Description: Datasheet; ComponentLink1URL: https://www.nxp.com/docs/en/data-sheet/PCF85263A.pdf
Y1 = CMP-008-0001: Crystal 0.032768MHz ±20ppm (Tol) 12.5pF FUND 90000Ohm Automotive 2-Pin Ultra Mini-CSMD T/R; MFR2#: FC-12M32.7680KA-A3; MFR: ECS Inc.; MFR#: ECS-.327-12.5-12QS-TR; Quality: AEC-Q200; Temp Range: -40 / +125 C; ESR (Equivalent Series Resistance): 90kR; MFR2: Epson; Capacitance, Load: 12.5pF; Frequency Tolerance: 20ppm; Design Item ID: XTAL/32.768kHz/ECS-.327-12.5-12QS-TR; RoHS Compliant: Yes; Value: 32.768kHz; Frequency: 32.768kHz; Load Capacitance: 12.5pF

## Nets that join several sheets
5V6: pico (D2.2), Connectors (5 pins), leds (R244.2)
GND: pico (8 pins), Connectors (24 pins), leds (6 pins), i2c_mux (6 pins), analog_converter (26 pins), display (J23.2 J24.2), thermocouple_1 (96 pins), thermocouple_2 (96 pins), current_sense (48 pins), pwm_driver (C24.2 C25.2 U3.14), FETS (48 pins), rtc (B1.1 C102.2 C103.2 U22.4)
PICO_ADA_3V3: pico (J26.5), Connectors (J2.2 J30.2 R282.2), i2c_mux (15 pins), analog_converter (U20.5 U20.29 U20.36), thermocouple_1 (48 pins), thermocouple_2 (48 pins), current_sense (32 pins), pwm_driver (12 pins), rtc (5 pins)
V_BUS: pico (D2.1 J26.1), leds (C99.1 LD4.2 R245.2), display (J23.1 J24.1)
V_FET_P: Connectors (22 pins), leds (17 pins)
VIN_PROT: Connectors (5 pins), leds (R242.2)
ADC_CHIP_SEL: pico (J25.9), analog_converter (U20.31)
ADC_IN1: analog_converter (R196.2), current_sense (R220.2)
ADC_IN2: analog_converter (R188.2), current_sense (R221.2)
ADC_IN3: analog_converter (R197.2), current_sense (R222.2)
ADC_IN4: analog_converter (R189.2), current_sense (R223.2)
ADC_IN5: analog_converter (R198.2), current_sense (R224.2)
ADC_IN6: analog_converter (R190.2), current_sense (R225.2)
ADC_IN7: analog_converter (R199.2), current_sense (R226.2)
ADC_IN8: analog_converter (R191.2), current_sense (R227.2)
ADC_IN9: analog_converter (R200.2), current_sense (R228.2)
ADC_IN10: analog_converter (R192.2), current_sense (R229.2)
ADC_IN11: analog_converter (R201.2), current_sense (R230.2)
ADC_IN12: analog_converter (R193.2), current_sense (R231.2)
ADC_IN13: analog_converter (R202.2), current_sense (R232.2)
ADC_IN14: analog_converter (R194.2), current_sense (R233.2)
ADC_IN15: analog_converter (R219.2), current_sense (R234.2)
ADC_IN16: analog_converter (R195.2), current_sense (R235.2)
BUTTON: pico (J25.15), Connectors (C101.2 J28.1 R282.1)
CAP_TOUCH_INT: pico (J25.20), display (J23.13 J24.13)
CAP_TOUCH_RST: pico (J25.19), display (J23.11 J24.11)
DISP_BACKLIGHT: pico (J25.17), display (J23.8 J24.8)
DISP_CS: pico (J26.19), display (J23.3 J24.3)
DISP_DC: pico (J26.15), display (J23.5 J24.5)
DISP_RST: pico (J26.14), display (J23.4 J24.4)
DISP_SD_CARD_CS: pico (J26.12), display (J23.14 J24.14)
FET_GATE1: pwm_driver (U3.6), FETS (R2.1)
FET_GATE2: pwm_driver (U3.7), FETS (R10.1)
FET_GATE3: pwm_driver (U3.8), FETS (R18.1)
FET_GATE4: pwm_driver (U3.9), FETS (R26.1)
FET_GATE5: pwm_driver (U3.10), FETS (R3.1)
FET_GATE6: pwm_driver (U3.11), FETS (R11.1)
FET_GATE7: pwm_driver (U3.12), FETS (R19.1)
FET_GATE8: pwm_driver (U3.13), FETS (R27.1)
FET_GATE9: pwm_driver (U3.15), FETS (R4.1)
FET_GATE10: pwm_driver (U3.16), FETS (R12.1)
FET_GATE11: pwm_driver (U3.17), FETS (R20.1)
FET_GATE12: pwm_driver (U3.18), FETS (R28.1)
FET_GATE13: pwm_driver (U3.19), FETS (R5.1)
FET_GATE14: pwm_driver (U3.20), FETS (R13.1)
FET_GATE15: pwm_driver (U3.21), FETS (R21.1)
FET_GATE16: pwm_driver (U3.22), FETS (R29.1)
I2C0_SCL: pico (J25.12), Connectors (J2.4), i2c_mux (R271.1 U21.14), display (J23.10 J24.10)
I2C0_SDA: pico (J25.11), Connectors (J2.3), i2c_mux (R272.1 U21.15), display (J23.12 J24.12)
I2C1_SCL: pico (J25.5), Connectors (J30.4), pwm_driver (R35.1 U3.26), rtc (R284.1 U22.6)
I2C1_SDA: pico (J25.4), Connectors (J30.3), pwm_driver (R34.1 U3.27), rtc (R285.1 U22.5)
I2C_MUX_RESET: pico (J25.16), i2c_mux (R270.1)
I2C_MUX_SCL0: Connectors (J20.4), i2c_mux (R280.1 U21.5), thermocouple_2 (16 pins)
I2C_MUX_SCL1: Connectors (J21.4), i2c_mux (R278.1 U21.7)
I2C_MUX_SCL2: Connectors (J22.4), i2c_mux (R276.1 U21.10)
I2C_MUX_SCL3: Connectors (J27.4), i2c_mux (R274.1 U21.12)
I2C_MUX_SDA0: Connectors (J20.3), i2c_mux (R281.1 U21.4), thermocouple_2 (16 pins)
I2C_MUX_SDA1: Connectors (J21.3), i2c_mux (R279.1 U21.6)
I2C_MUX_SDA2: Connectors (J22.3), i2c_mux (R277.1 U21.9)
I2C_MUX_SDA3: Connectors (J27.3), i2c_mux (R275.1 U21.11)
I_SNS_N1: leds (LD6.1), current_sense (U4.5), FETS (Q3.7 Q3.8 R206.1)
I_SNS_N2: leds (LD10.1), current_sense (U5.5), FETS (Q3.5 Q3.6 R210.2)
I_SNS_N3: leds (LD12.1), current_sense (U6.5), FETS (Q7.7 Q7.8 R211.2)
I_SNS_N4: leds (LD15.1), current_sense (U7.5), FETS (Q7.5 Q7.6 R218.1)
I_SNS_N5: leds (LD18.1), current_sense (U8.5), FETS (Q4.7 Q4.8 R203.1)
I_SNS_N6: leds (LD20.1), current_sense (U9.5), FETS (Q4.5 Q4.6 R207.1)
I_SNS_N7: leds (LD7.1), current_sense (U10.5), FETS (Q8.7 Q8.8 R212.1)
I_SNS_N8: leds (LD9.1), current_sense (U11.5), FETS (Q8.5 Q8.6 R215.1)
I_SNS_N9: leds (LD13.1), current_sense (U12.5), FETS (Q5.7 Q5.8 R204.1)
I_SNS_N10: leds (LD16.1), current_sense (U13.5), FETS (Q5.5 Q5.6 R208.1)
I_SNS_N11: leds (LD19.1), current_sense (U14.5), FETS (Q9.7 Q9.8 R213.1)
I_SNS_N12: leds (LD21.1), current_sense (U15.5), FETS (Q9.5 Q9.6 R216.1)
I_SNS_N13: leds (LD8.1), current_sense (U16.5), FETS (Q6.7 Q6.8 R205.1)
I_SNS_N14: leds (LD11.1), current_sense (U17.5), FETS (Q6.5 Q6.6 R209.1)
I_SNS_N15: leds (LD14.1), current_sense (U18.5), FETS (Q10.7 Q10.8 R214.1)
I_SNS_N16: leds (LD17.1), current_sense (U19.5), FETS (Q10.5 Q10.6 R217.1)
I_SNS_P1: Connectors (J12.2), current_sense (U4.4), FETS (R206.2)
I_SNS_P2: Connectors (J12.4), current_sense (U5.4), FETS (R210.1)
I_SNS_P3: Connectors (J13.2), current_sense (U6.4), FETS (R211.1)
I_SNS_P4: Connectors (J13.4), current_sense (U7.4), FETS (R218.2)
I_SNS_P5: Connectors (J14.2), current_sense (U8.4), FETS (R203.2)
I_SNS_P6: Connectors (J14.4), current_sense (U9.4), FETS (R207.2)
I_SNS_P7: Connectors (J15.2), current_sense (U10.4), FETS (R212.2)
I_SNS_P8: Connectors (J15.4), current_sense (U11.4), FETS (R215.2)
I_SNS_P9: Connectors (J16.2), current_sense (U12.4), FETS (R204.2)
I_SNS_P10: Connectors (J16.4), current_sense (U13.4), FETS (R208.2)
I_SNS_P11: Connectors (J17.2), current_sense (U14.4), FETS (R213.2)
I_SNS_P12: Connectors (J17.4), current_sense (U15.4), FETS (R216.2)
I_SNS_P13: Connectors (J18.2), current_sense (U16.4), FETS (R205.2)
I_SNS_P14: Connectors (J18.4), current_sense (U17.4), FETS (R209.2)
I_SNS_P15: Connectors (J19.2), current_sense (U18.4), FETS (R214.2)
I_SNS_P16: Connectors (J19.4), current_sense (U19.4), FETS (R217.2)
OUTPUT_ENABLE: pico (J25.6), pwm_driver (R42.1 U3.23)
RGBW_LED: pico (J25.10), leds (R246.1)
RTC_INTA: pico (J25.14), rtc (R283.2 U22.7)
SPI0_CLK: pico (J26.17), analog_converter (U20.32), display (J23.7 J24.7)
SPI0_MISO: pico (J26.20), analog_converter (U20.34), display (J23.9 J24.9)
SPI0_MOSI: pico (J26.16), analog_converter (U20.33), display (J23.6 J24.6)
TC_NEG1: Connectors (J4.2), thermocouple_1 (R69.2)
TC_NEG2: Connectors (J4.4), thermocouple_1 (R64.2)
TC_NEG3: Connectors (J5.2), thermocouple_1 (R67.2)
TC_NEG4: Connectors (J5.4), thermocouple_1 (R96.2)
TC_NEG5: Connectors (J6.2), thermocouple_1 (R91.2)
TC_NEG6: Connectors (J6.4), thermocouple_1 (R93.2)
TC_NEG7: Connectors (J7.2), thermocouple_1 (R112.2)
TC_NEG8: Connectors (J7.4), thermocouple_1 (R114.2)
TC_NEG9: Connectors (J8.2), thermocouple_2 (R141.2)
TC_NEG10: Connectors (J8.4), thermocouple_2 (R137.2)
TC_NEG11: Connectors (J9.2), thermocouple_2 (R139.2)
TC_NEG12: Connectors (J9.4), thermocouple_2 (R168.2)
TC_NEG13: Connectors (J10.2), thermocouple_2 (R163.2)
TC_NEG14: Connectors (J10.4), thermocouple_2 (R165.2)
TC_NEG15: Connectors (J11.2), thermocouple_2 (R184.2)
TC_NEG16: Connectors (J11.4), thermocouple_2 (R186.2)
TC_POS1: Connectors (J4.1), thermocouple_1 (R68.2)
TC_POS2: Connectors (J4.3), thermocouple_1 (R65.2)
TC_POS3: Connectors (J5.1), thermocouple_1 (R66.2)
TC_POS4: Connectors (J5.3), thermocouple_1 (R95.2)
TC_POS5: Connectors (J6.1), thermocouple_1 (R90.2)
TC_POS6: Connectors (J6.3), thermocouple_1 (R92.2)
TC_POS7: Connectors (J7.1), thermocouple_1 (R111.2)
TC_POS8: Connectors (J7.3), thermocouple_1 (R113.2)
TC_POS9: Connectors (J8.1), thermocouple_2 (R140.2)
TC_POS10: Connectors (J8.3), thermocouple_2 (R136.2)
TC_POS11: Connectors (J9.1), thermocouple_2 (R138.2)
TC_POS12: Connectors (J9.3), thermocouple_2 (R167.2)
TC_POS13: Connectors (J10.1), thermocouple_2 (R162.2)
TC_POS14: Connectors (J10.3), thermocouple_2 (R164.2)
TC_POS15: Connectors (J11.1), thermocouple_2 (R183.2)
TC_POS16: Connectors (J11.3), thermocouple_2 (R185.2)
UART_RXD: pico (J25.2), Connectors (J1.3)
UART_TXD: pico (J25.1), Connectors (J1.1)
VFET_EN: pico (J25.7), Connectors (R1.2)

## Assembly variants
Disp TH: all parts fitted
Disp FFC: all parts fitted